# EAGLE board Xtriker_Laser_v2 (EAGLE 9.6.1)
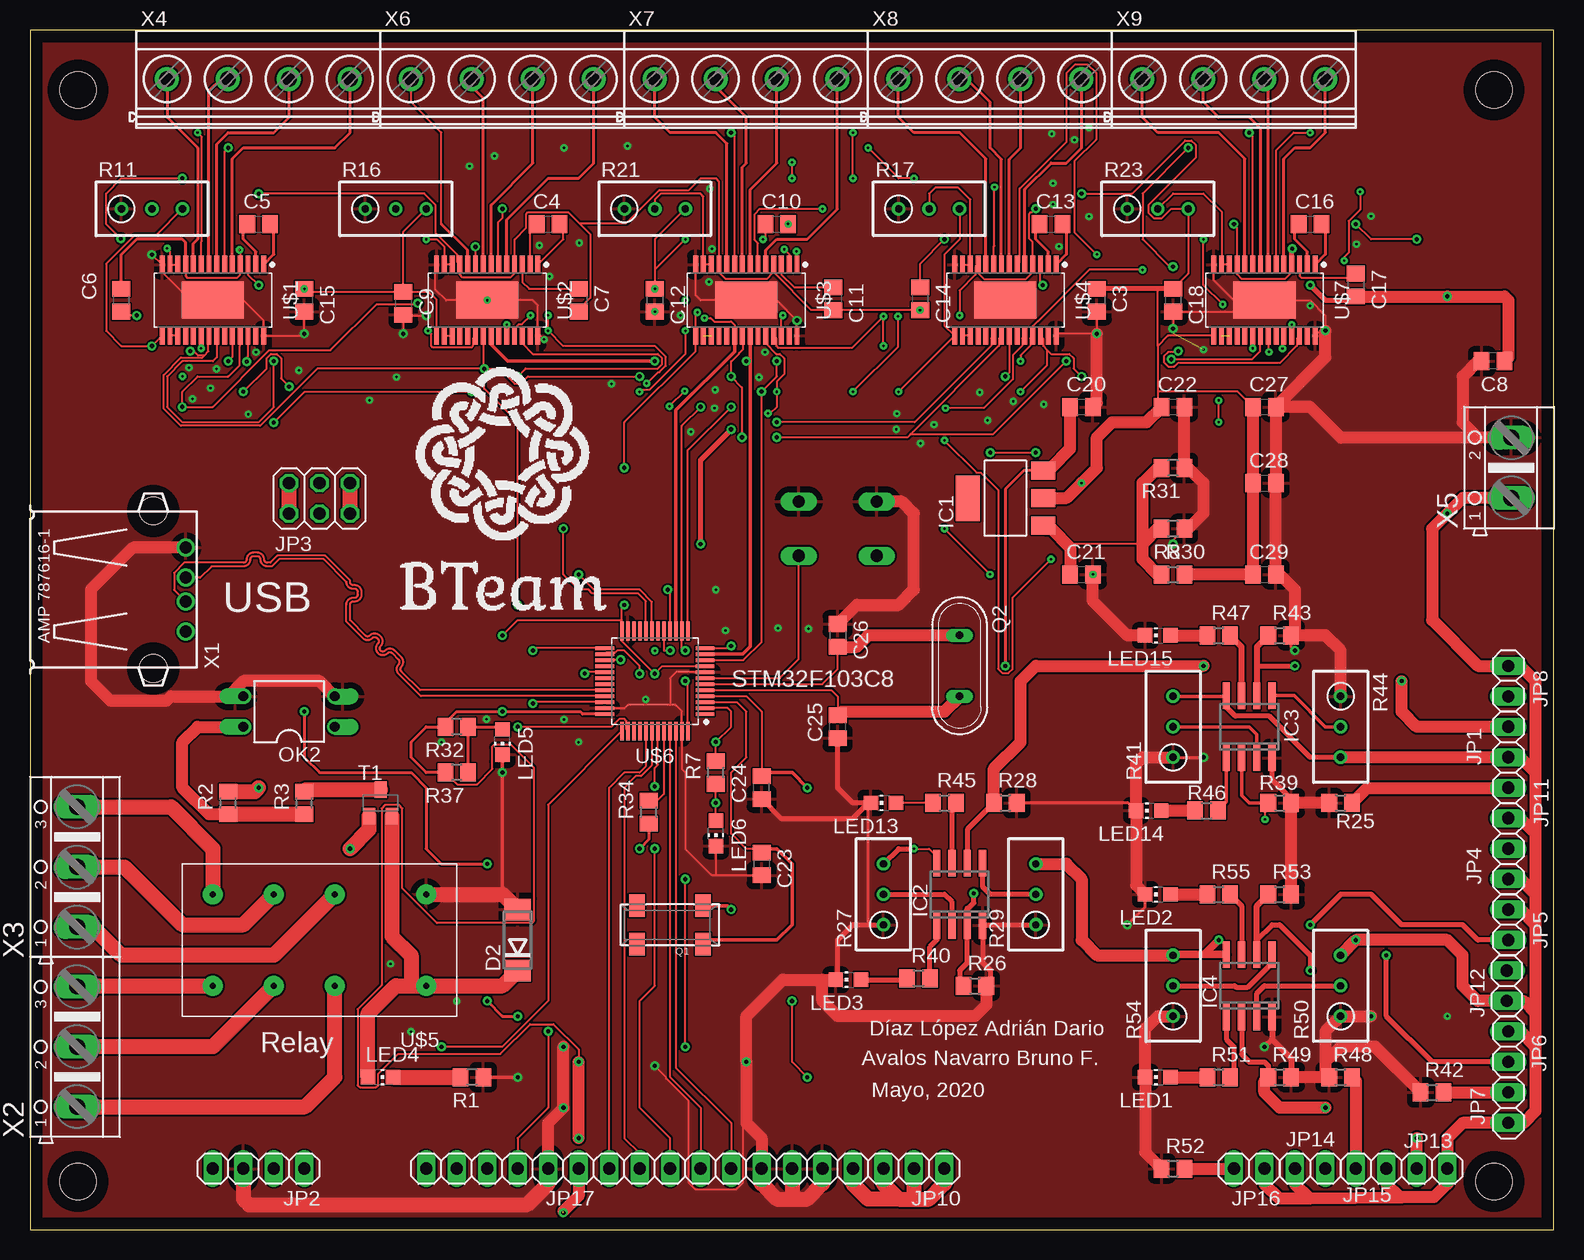
[diagram p2: board, top side]
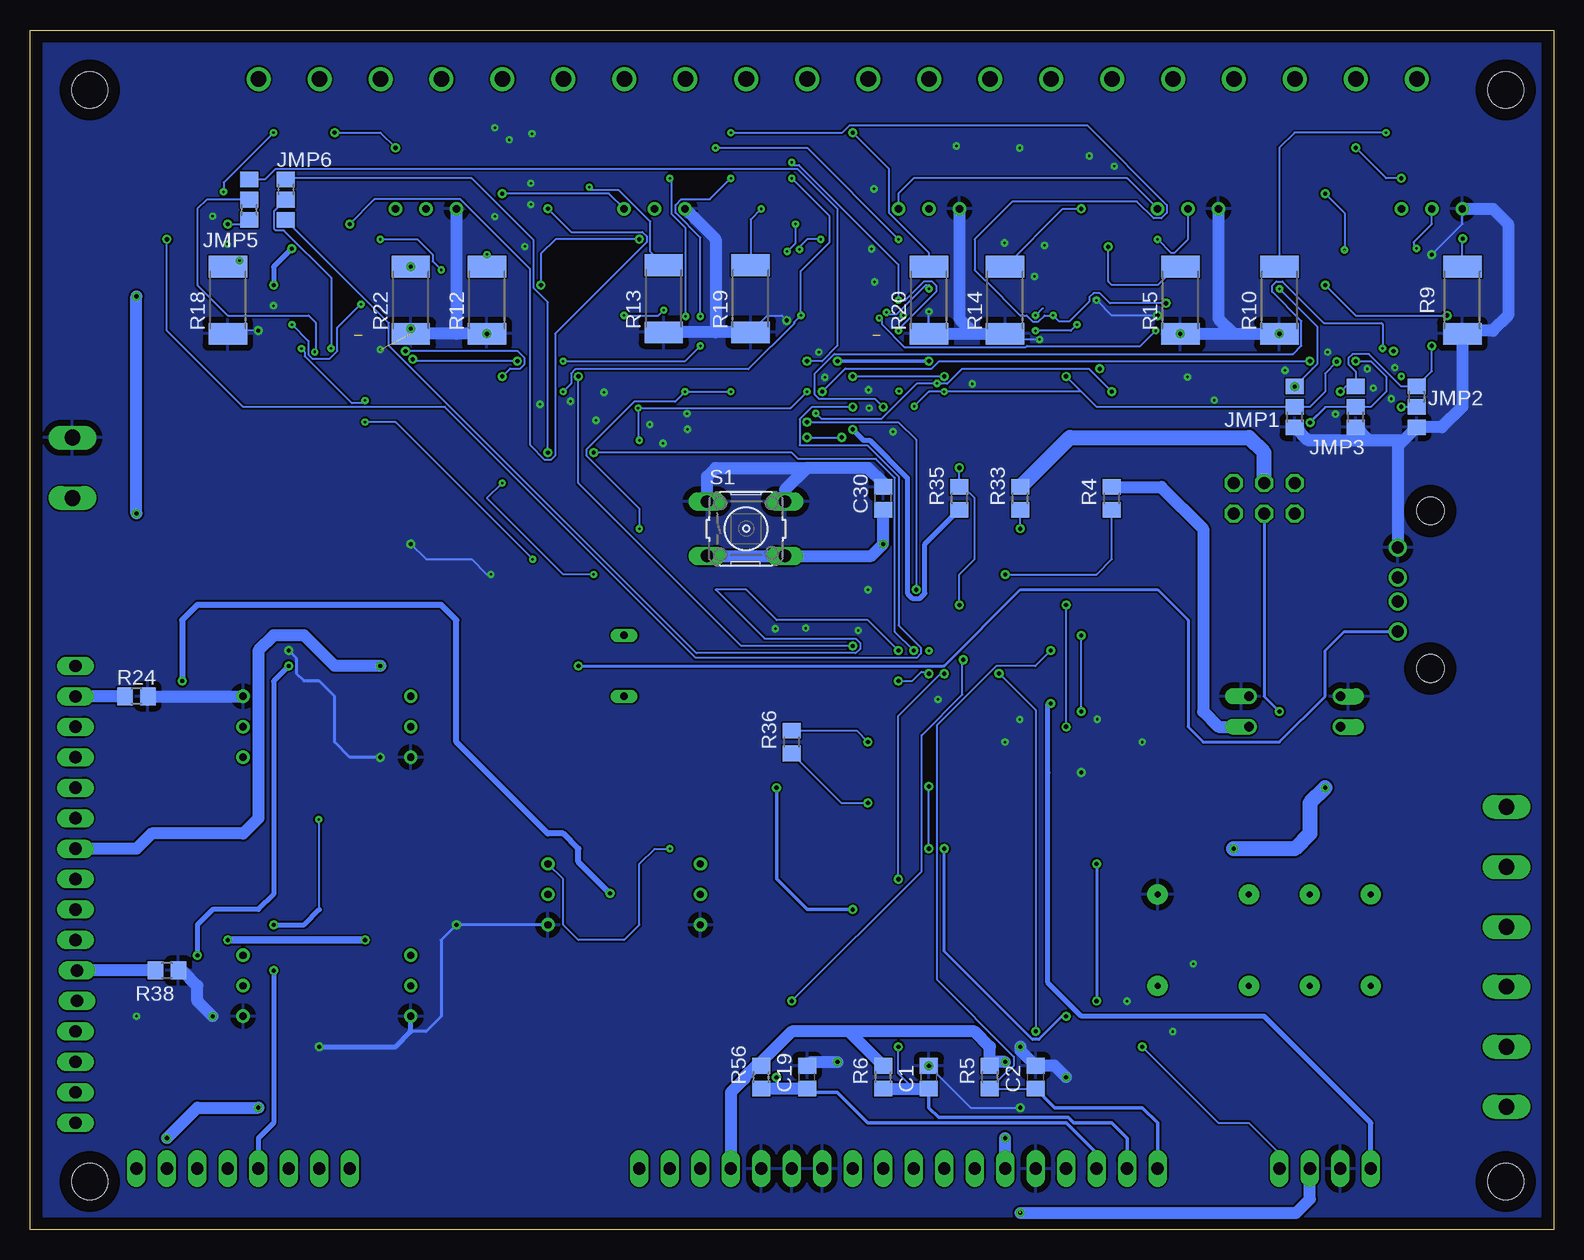
[diagram p3: board, bottom side, seen from below]

Size 126.98 x 100 mm. Coordinates in mm from the lower left corner, seen from the top.
Outline: 0,0 126.98,0 126.98,100 0,100 0,0
Copper layers (1*16): Top 0.035mm / dielectric 1.5mm / Bottom 0.035mm
Design rules "default *": minimum track width 6mil, minimum drill 0.2mm, track to track 6mil, track to pad 6mil, pad to pad 6mil, via to via 6mil, smd to smd 6mil, copper to edge 40mil, drill to drill 10mil, minimum pad ring 10mil, minimum via ring 8mil, stop-mask expansion 4mil, vias tented up to drill 0mil, thermal gap 20mil
Net classes: 1 Diff: width 0.152 mm
Holes 3 mm at 4,95 122,95 122,4 4,4

## Footprints (pad centres in the part's own frame; a part is rotated, then mirrored left to right if it is on the bottom)
C0805 = smd 1.3 x 1.5: 1 -0.95,0; 2 0.95,0
DO214AA = smd 1.8 x 2.2: A 2.55,0; C -2.55,0
SOT223 = smd 1.499 x 2.007: 1 -2.261,-3.15; 2 0.025,-3.15; 3 2.311,-3.15 | smd 3.81 x 2.007: 4 0,3.15
SO08 = smd 0.6 x 2.2: 1 -1.905,-2.6; 2 -0.635,-2.6; 3 0.635,-2.6; 4 1.905,-2.6; 5 1.905,2.6; 6 0.635,2.6; 7 -0.635,2.6; 8 -1.905,2.6
A0R-JMP = smd 1.5 x 1.3: 1 0,1.7; 2 0,0; 3 0,-1.7
1X02 = drill 1.016 long: 1 -1.27,0; 2 1.27,0
1X04 = drill 1.016 long: 1 -3.81,0; 2 -1.27,0; 3 1.27,0; 4 3.81,0
2X03 = drill 1.016 octagon: 1 -2.54,-1.27; 2 -2.54,1.27; 3 0,-1.27; 4 0,1.27; 5 2.54,-1.27; 6 2.54,1.27
1X12 = drill 1.016 long: 1 -13.97,0; 2 -11.43,0; 3 -8.89,0; 4 -6.35,0; 5 -3.81,0; 6 -1.27,0; 7 1.27,0; 8 3.81,0; 9 6.35,0; 10 8.89,0; 11 11.43,0; 12 13.97,0
1X06 = drill 1.016 long: 1 -6.35,0; 2 -3.81,0; 3 -1.27,0; 4 1.27,0; 5 3.81,0; 6 6.35,0
CHIP-LED0805 = smd 1.2 x 1.2: A 0,-1.05; C 0,1.05
DIL04 = drill 0.813 offset: 1 -1.27,-3.81; 2 1.27,-3.81; 3 1.27,3.81; 4 -1.27,3.81
8.2X3.8 = smd 1.3 x 1.9: 1 -2.75,-1.6; 2 2.75,-1.6; 3 2.75,1.6; 4 -2.75,1.6
QS = drill 0.61 long: 1 -2.54,0; 2 2.54,0
R0805 = smd 1.3 x 1.5: 1 -0.95,0; 2 0.95,0
R2512 = smd 1.8 x 3.2: 1 -2.8,0; 2 2.8,0
RTRIM3296W = drill 0.61: 1 0,-2.54; 2 0,0; 3 0,2.54
B3F-10XX = drill 1.016 long: 1 -3.251,2.261; 2 3.251,2.261; 3 -3.251,-2.261; 4 3.251,-2.261
SOT23-BCE = smd 1 x 1.4: B -0.95,-1.1; C 0.95,-1.1; E 0,1.1
SOP65P660X135-29T310X518N = smd 1.478 x 0.407: 1 -2.967,4.225; 2 -2.967,3.575; 3 -2.967,2.925; 4 -2.967,2.275; 5 -2.967,1.625; 6 -2.967,0.975; 7 -2.967,0.325; 8 -2.967,-0.325; 9 -2.967,-0.975; 10 -2.967,-1.625; 11 -2.967,-2.275; 12 -2.967,-2.925; 13 -2.967,-3.575; 14 -2.967,-4.225; 15 2.967,-4.225; 16 2.967,-3.575; 17 2.967,-2.925; 18 2.967,-2.275; 19 2.967,-1.625; 20 2.967,-0.975; 21 2.967,-0.325; 22 2.967,0.325; 23 2.967,0.975; 24 2.967,1.625; 25 2.967,2.275; 26 2.967,2.925; 27 2.967,3.575; 28 2.967,4.225 | smd 3.1 x 5.18: 29 0,0
TDS_1202L = drill 0.5 pad 1.676: P1 -2.54,-2.54; P2 5.08,-2.54; P3 10.16,-2.54; P4 15.24,-2.54; P5 15.24,5.08; P6 10.16,5.08; P7 5.08,5.08; P8 -2.54,5.08
QFP50P900X900X160-48N = smd 1.559 x 0.28: 1 -4.178,2.75; 2 -4.178,2.25; 3 -4.178,1.75; 4 -4.178,1.25; 5 -4.178,0.75; 6 -4.178,0.25; 7 -4.178,-0.25; 8 -4.178,-0.75; 9 -4.178,-1.25; 10 -4.178,-1.75; 11 -4.178,-2.25; 12 -4.178,-2.75; 25 4.178,-2.75; 26 4.178,-2.25; 27 4.178,-1.75; 28 4.178,-1.25; 29 4.178,-0.75; 30 4.178,-0.25; 31 4.178,0.25; 32 4.178,0.75; 33 4.178,1.25; 34 4.178,1.75; 35 4.178,2.25; 36 4.178,2.75 | smd 0.28 x 1.559: 13 -2.75,-4.178; 14 -2.25,-4.178; 15 -1.75,-4.178; 16 -1.25,-4.178; 17 -0.75,-4.178; 18 -0.25,-4.178; 19 0.25,-4.178; 20 0.75,-4.178; 21 1.25,-4.178; 22 1.75,-4.178; 23 2.25,-4.178; 24 2.75,-4.178; 37 2.75,4.178; 38 2.25,4.178; 39 1.75,4.178; 40 1.25,4.178; 41 0.75,4.178; 42 0.25,4.178; 43 -0.25,4.178; 44 -0.75,4.178; 45 -1.25,4.178; 46 -1.75,4.178; 47 -2.25,4.178; 48 -2.75,4.178
USB = drill 1: 1 -3.5,12.99; 2 -1,12.99; 3 1,12.99; 4 3.5,12.99 | hole 2.3: -6.57,10.28; 6.57,10.28
AK500/3 = drill 1.321 long: 1 -5.004,0; 2 0,0; 3 5.004,0
MKDSN1,5/4-5,08 = drill 1.3 pad 2: 1 -7.641,0.025; 2 -2.561,0.025; 3 2.519,0.025; 4 7.599,0.025
AK500/2 = drill 1.321 long: 1 -2.515,0; 2 2.515,0

## Placement (x,y rotation side)
C1  100nF  [C0805]  52.07,12.7 90 bottom
C2  100nF  [C0805]  43.18,12.7 90 bottom
C3  0.47µF  [C0805]  88.9,77.47 270 top
C4  10nF  [C0805]  43.18,83.82 0 top
C5  10nF  [C0805]  19.05,83.82 0 top
C6  0.1µF  [C0805]  7.62,77.47 90 top
C7  0.1µF  [C0805]  45.72,77.47 270 top
C8  100µF  [C0805]  121.92,72.39 180 top
C9  0.47µF  [C0805]  31.11,77.22 270 top
C10  10nF  [C0805]  62.23,83.82 0 top
C11  0.1µF  [C0805]  66.93,77.6 270 top
C12  0.47µF  [C0805]  52.07,77.47 270 top
C13  10nF  [C0805]  85.09,83.82 0 top
C14  0.1µF  [C0805]  74.17,77.6 270 top
C15  0.47µF  [C0805]  22.86,77.47 270 top
C16  10nF  [C0805]  106.68,83.82 0 top
C17  0.1µF  [C0805]  110.49,78.74 270 top
C18  0.47µF  [C0805]  95.25,77.47 270 top
C19  100nF  [C0805]  62.23,12.7 90 bottom
C20  10µF  [C0805]  87.63,68.58 0 top
C21  10µF  [C0805]  87.63,54.61 0 top
C22  10µF  [C0805]  95.25,68.58 0 top
C23  0.1µF  [C0805]  60.96,30.48 270 top
C24  0.1µF  [C0805]  60.96,36.83 90 top
C25  0.1µF  [C0805]  67.31,41.91 90 top
C26  0.1µF  [C0805]  67.31,49.53 270 top
C27  100µF  [C0805]  102.87,68.58 0 top
C28  100µF  [C0805]  102.87,62.23 0 top
C29  100µF  [C0805]  102.87,54.61 0 top
C30  1µF  [C0805]  55.88,60.96 90 bottom
D2  [DO214AA]  40.64,24.13 90 top
IC1  REG1117  [SOT223]  81.28,60.96 90 top
IC2  LM358D  [SO08]  77.47,27.94 0 top
IC3  LM358D  [SO08]  101.6,41.91 0 top
IC4  LM358D  [SO08]  101.6,20.32 0 top
JMP1  0R-JUMPA  [A0R-JMP]  21.59,68.58 180 bottom
JMP2  0R-JUMPA  [A0R-JMP]  11.43,68.58 0 bottom
JMP3  0R-JUMPA  [A0R-JMP]  16.51,68.58 180 bottom
JMP5  0R-JUMPA  [A0R-JMP]  108.71,85.85 180 bottom
JMP6  0R-JUMPA  [A0R-JMP]  105.66,85.85 0 bottom
JP1  [1X02]  123.19,40.64 90 top
JP2  STLINK  [1X04]  19.05,5.08 180 top
JP3  BOOT_SELECTION  [2X03]  24.13,60.96 0 top
JP4  [1X02]  123.19,30.48 90 top
JP5  [1X02]  123.19,25.4 270 top
JP6  [1X02]  123.19,15.24 270 top
JP7  [1X02]  123.19,10.16 90 top
JP8  [1X02]  123.19,45.72 270 top
JP10  PINOUT  [1X12]  62.23,5.08 180 top
JP11  [1X02]  123.19,35.56 90 top
JP12  [1X02]  123.06,20.32 90 top
JP13  [1X02]  116.84,5.08 180 top
JP14  [1X02]  106.68,5.08 0 top
JP15  [1X02]  111.76,5.08 180 top
JP16  [1X02]  101.6,5.08 180 top
JP17  ENDSTOP_&_LASER  [1X06]  39.37,5.08 180 top
LED1  RED  [CHIP-LED0805]  93.98,12.7 90 top
LED2  RED  [CHIP-LED0805]  93.98,27.94 90 top
LED3  GREEN  [CHIP-LED0805]  68.2,20.83 90 top
LED4  ORANGE  [CHIP-LED0805]  29.21,12.7 270 top
LED5  RED  [CHIP-LED0805]  39.37,40.64 180 top
LED6  GREEN  [CHIP-LED0805]  57.15,33.02 180 top
LED13  GREEN  [CHIP-LED0805]  71.12,35.56 90 top
LED14  ORANGE  [CHIP-LED0805]  93.22,34.92 90 top
LED15  ORANGE  [CHIP-LED0805]  93.98,49.53 90 top
OK2  PC817  [DIL04]  21.59,43.18 90 top
Q1  32,768K  [8.2X3.8]  53.34,25.4 180 top
Q2  8MHz  [QS]  77.47,46.99 270 top
R1  470  [R0805]  36.83,12.7 180 top
R2  2k2  [R0805]  16.51,35.56 90 top
R3  10k  [R0805]  22.86,35.56 90 top
R4  200  [R0805]  36.83,60.96 90 bottom
R5  4k7  [R0805]  46.99,12.7 90 bottom
R6  4k7  [R0805]  55.88,12.7 90 bottom
R7  120  [R0805]  57.15,38.1 90 top
R8  820  [R0805]  95.25,58.42 180 top
R9  0.1  [R2512]  7.62,77.47 90 bottom
R10  0.1  [R2512]  22.86,77.47 90 bottom
R11  [RTRIM3296W]  10.16,85.09 270 top
R12  0.1  [R2512]  88.9,77.47 90 bottom
R13  0.1  [R2512]  74.17,77.6 90 bottom
R14  0.1  [R2512]  45.72,77.47 90 bottom
R15  0.1  [R2512]  31.11,77.47 90 bottom
R16  [RTRIM3296W]  30.48,85.09 270 top
R17  [RTRIM3296W]  74.93,85.09 270 top
R18  0.1  [R2512]  110.49,77.47 90 bottom
R19  0.1  [R2512]  66.93,77.6 90 bottom
R20  0.1  [R2512]  52.07,77.47 90 bottom
R21  [RTRIM3296W]  52.07,85.09 270 top
R22  0.1  [R2512]  95.25,77.47 90 bottom
R23  [RTRIM3296W]  93.98,85.09 270 top
R24  4k7  [R0805]  118.11,44.45 180 bottom
R25  470  [R0805]  109.22,35.56 0 top
R26  10k  [R0805]  78.74,20.32 0 top
R27  10k  [RTRIM3296W]  71.12,27.94 0 top
R28  10k  [R0805]  81.28,35.56 0 top
R29  10k  [RTRIM3296W]  83.82,27.94 0 top
R30  100  [R0805]  95.25,54.61 0 top
R31  200  [R0805]  95.25,63.5 180 top
R32  120  [R0805]  35.56,41.91 180 top
R33  100k  [R0805]  44.45,60.96 90 bottom
R34  100k  [R0805]  51.56,34.8 90 top
R35  10k  [R0805]  49.53,60.96 90 bottom
R36  180  [R0805]  63.5,40.64 90 bottom
R37  180  [R0805]  35.56,38.1 180 top
R38  470  [R0805]  115.57,21.59 180 bottom
R39  10k  [R0805]  104.14,35.56 0 top
R40  330  [R0805]  74.04,20.95 0 top
R41  10k  [RTRIM3296W]  95.25,41.91 0 top
R42  470  [R0805]  116.84,11.43 0 top
R43  10k  [R0805]  104.14,49.53 0 top
R44  10k  [RTRIM3296W]  109.22,41.91 180 top
R45  330  [R0805]  76.2,35.56 0 top
R46  330  [R0805]  98.04,34.92 0 top
R47  330  [R0805]  99.06,49.53 0 top
R48  4k7  [R0805]  109.22,12.7 0 top
R49  10k  [R0805]  104.14,12.7 0 top
R50  10k  [RTRIM3296W]  109.22,20.32 0 top
R51  330  [R0805]  99.06,12.7 0 top
R52  470  [R0805]  95.25,5.08 0 top
R53  10k  [R0805]  104.14,27.94 0 top
R54  10k  [RTRIM3296W]  95.25,20.32 0 top
R55  330  [R0805]  99.06,27.94 0 top
R56  4k7  [R0805]  66.04,12.7 90 bottom
S1  RESET_BUTTON  [B3F-10XX]  67.31,58.42 0 bottom
T1  [SOT23-BCE]  29.21,35.56 0 top
U$1  DRV8825  [SOP65P660X135-29T310X518N]  15.24,77.47 270 top
U$2  DRV8825  [SOP65P660X135-29T310X518N]  38.1,77.47 270 top
U$3  DRV8825  [SOP65P660X135-29T310X518N]  59.69,77.47 270 top
U$4  DRV8825  [SOP65P660X135-29T310X518N]  81.28,77.47 270 top
U$5  TDS-1202L  [TDS_1202L]  30.48,25.4 180 top
U$6  STM32F103C8_LQFP48  [QFP50P900X900X160-48N]  52.07,45.72 180 top
U$7  DRV8825  [SOP65P660X135-29T310X518N]  102.87,77.47 270 top
X1  USB_VCP  [USB]  0,53.34 270 top
X2  [AK500/3]  3.94,15.24 90 top
X3  [AK500/3]  3.94,30.23 90 top
X4  MKDSN1,5/4-5,08  [MKDSN1,5/4-5,08]  19.05,95.89 0 top
X5  [AK500/2]  123.44,63.5 90 top
X6  MKDSN1,5/4-5,08  [MKDSN1,5/4-5,08]  39.37,95.89 0 top
X7  MKDSN1,5/4-5,08  [MKDSN1,5/4-5,08]  59.69,95.89 0 top
X8  MKDSN1,5/4-5,08  [MKDSN1,5/4-5,08]  80.01,95.89 0 top
X9  MKDSN1,5/4-5,08  [MKDSN1,5/4-5,08]  100.33,95.89 0 top

## Tracks (layer width: path | path; a pad name or v marks a point on that pad's centre or on a via)
3V  (via drill 0.2, 0.35)  (1 unrouted)
  Top 0.152: 49.32,50.8 U$6.24 49.32,49.08 v52.07,46.33 52.71,46.97 U$6.9 | 49.32,50.8 49.32,51.86 v49.53,52.07 | v49.53,63.5 49.53,67.31 55.47,73.25 U$3.15 55.47,76.32 v55.61,76.47 | U$7.15 94.82,74.5 93.98,73.66 | 93.98,73.66 93.98,69.85 | 93.98,69.85 93.98,68.9 C22.1 | U$2.15 33.88,77.5 33.21,78.17 C9.1 | U$6.48 54.82,45.51 v54.61,45.72 | C9.1 31.11,83.19 R16.3 | R21.3 52.07,82.55 52.07,80.01 | C18.1 96.52,79.69 R23.3 95.09,85.09 94.31,84.3 93.65,84.3 93.19,84.76 93.19,85.42 97.13,89.35 97.13,90.42 96.77,90.78 96.27,90.78 91.85,86.36 v87.63,86.36 | C9.1 23.11,78.17 C15.1 | U$1.15 11,74.5 v10.16,73.66 7.62,73.66 6.35,74.93 6.35,80.51 8.74,82.91 10.52,82.91 R11.3 | JMP1.3 20.93,70.94 20.93,72.64 20.57,73 20.07,73 19.71,72.64 19.71,71.78 v17.78,69.85 | R17.3 77.47,82.55 76.2,81.28 76.2,75.36 U$4.15 72.4,69.85 v72.39,69.85 | R37.2 35.59,37.12 37.26,37.12 38.54,38.41 38.54,40.28 38.67,40.42 40.06,40.42 41.97,38.52 41.97,25.68 41.84,25.55 33.9,25.55 31.02,28.43 31.02,35.12 30.75,35.39 29.57,35.39 29.3,35.12 29.3,20.36 27.3,18.36 27.3,12.04 27.5,11.84 28.82,11.84 29.02,12.04 29.02,12.99 30.67,14.63 39.19,14.63 41.68,17.12 43.62,17.12 45.72,15.01 45.72,12.7 | v39.37,49.53 40.64,50.8 49.32,50.8 | C27.1 100.65,69.85 93.98,69.85 | 93.98,73.66 93.98,78.42 | C12.1 52.07,78.74 52.07,80.01 | v76.2,58.42 v80.01,54.61 | v68.58,69.85 72.34,73.61 v72.34,76.11 | v73.66,87.63 72.39,87.63 v69.85,90.17 | v54.61,82.55 52.07,80.01
  Top 0.254: R37.2 33.02,38.1 31.75,39.37 31.75,40.64 33.02,41.91 R32.2 34.61,42.23 35.56,43.18 v39.37,43.18 45.85,43.18 46.06,42.97 U$6.36
  Top 0.406: C18.1 93.98,78.42 C3.1
  Top 1.016: IC1.2 86.39,60.98 v87.63,62.23 88.9,63.5 88.9,66.04 90.17,67.31 93.03,67.31 C22.1 | R30.2 C29.1 C28.1 C27.1 | v45.72,7.62 45.72,12.7 v45.72,13.97 | JP17.1 45.72,2.79 44.45,1.52
  Top 1.27: JP10.3 71.12,3.81 72.39,2.54 | JP10.1 76.2,3.81 74.93,2.54 73.66,2.54 | 72.39,2.54 73.66,2.54 | JP10.2 73.66,2.54 | 72.39,2.54 69.85,2.54 68.58,3.81 JP10.4
  Bottom 0.152: v49.53,52.07 49.53,54.61 48.26,55.88 48.26,60.96 49.21,61.91 R35.2 v49.53,63.5 | v54.61,45.72 53.47,45.72 52.7,46.48 52.22,46.48 v52.07,46.33 | C12.1 52.07,78.74 52.32,78.74 54.74,76.33 55.47,76.33 v55.61,76.47 | JMP1.3 20.09,71.78 20.07,71.78 19.71,72.14 19.71,75.27 C15.1 | v10.16,73.66 10.16,71.55 JMP2.1 12.7,70.28 15.42,73 16.76,73 17.12,72.64 17.12,72.14 16.51,71.53 JMP3.3 17.35,70.28 v17.78,69.85 | v39.37,43.18 v39.37,49.53 | R16.3 35.56,87.63 53.34,87.63 54.61,86.36 R21.3 | R17.3 78.74,86.36 v87.63,86.36 | v76.2,58.42 76.2,60.1 80.62,64.52 80.62,65.02 76.63,69.01 73.23,69.01 v72.39,69.85 v68.58,69.85 | v80.01,54.61 82.55,54.61 88.9,60.96 v87.63,62.23 | v72.34,76.11 72.34,79.4 72.34,83.5 73.48,84.64 73.48,87.45 v73.66,87.63 | v69.85,90.17 62.23,90.17 v54.61,82.55
  Bottom 1.016: JP10.4 68.58,11.43 67.45,12.56 67.45,12.67 66.47,13.65 R56.2 66.04,13.97 63.5,16.51 58.74,16.51 | R6.2 58.74,16.51 | 58.74,16.51 48.26,16.51 46.99,15.24 R5.2 46.67,13.97 v45.72,13.97 | JP17.1 v45.72,7.62 | v44.45,1.39 21.47,1.39 20.32,2.54 JP2.2
  other vias: 21.59,70.28 52.07,78.42 22.86,78.42
12V  (via drill 0.2, 0.35)  (1 unrouted)
  Top 0.152: U$3.4 62,80.4 62,79.76 | 62,79.76 61.9,79.76 61.39,79.25 57.99,79.25 57.41,79.82 U$3.11 57.41,87.36 57.15,87.63 55.88,87.63 54.91,86.67 52.45,86.67 49.67,83.89 45.79,83.89 | 62,79.76 65.11,76.65 C11.2 C14.2 | C7.2 45.72,76.7 46.7,77.67 46.7,82.97 45.79,83.89 | 45.79,83.89 44.88,84.8 41.48,84.8 41.35,84.67 41.35,83.52 40.38,82.54 U$2.4 40.38,79.75 40.01,79.38 36.07,79.38 35.81,79.63 35.81,80.43 U$2.11 35.61,80.66 35.61,81.27 33.81,83.07 33.81,85.42 32.86,86.36 v19.05,86.36 | 17.55,80.47 U$1.4 | U$1.11 12.96,79.49 13.08,79.38 17.27,79.38 17.52,79.62 U$1.4 | U$7.4 105.14,79.82 104.57,79.25 100.96,79.25 100.58,79.63 100.58,80.43 U$7.11 100.59,83.56 v100.33,83.82 | v83.82,85.1 83.52,84.8 83.39,84.8 83.26,84.67 83.26,82.61 83.56,82.31 U$4.4 83.56,79.82 82.98,79.25 79.5,79.25 79,79.75 U$4.11 78.79,80.22 78.79,79.6 77.47,78.29 v77.47,76.2 | v17.45,81.66 17.52,81.59 U$1.4 | v73.66,31.75 74.93,31.75 75.56,31.11
  Top 0.254: C6.2 7.62,81.28 8.89,82.55 12.7,82.55 12.96,82.28 U$1.11
  Top 0.305: R41.3 99.64,44.45 IC3.8
  Top 0.406: R27.3 72.39,31.75 v73.66,31.75 | 75.56,31.11 IC2.8 | R44.3 106.68,39.37 103.25,42.8 100.46,42.8 99.64,43.62 99.64,44.45 | U$7.4 105.14,81.73 v105.18,81.77 | v106.68,78.74 107.95,77.47 110.17,77.47 C17.2
  Top 0.61: R54.3 95.31,22.92 97.85,22.92 | 97.85,22.92 IC4.8 | v99.06,24.13 97.85,22.92
  Top 1.016: JP15.1 113.03,3.81 114.17,2.67 114.3,2.67 | 114.3,2.67 116.99,2.69 118.11,3.81 JP13.1 118.11,7.62 119.38,8.89 JP7.1 124.46,8.89 125.46,9.89 125.46,15.24 | JP14.1 105.41,3.81 106.63,2.59 | 114.3,2.67 106.68,2.59 106.63,2.59 | JP16.1 102.87,3.81 104.09,2.59 106.63,2.59 | JP6.1 124.19,16.51 125.46,15.24 | 125.46,18.05 124.46,19.05 JP12.1 120.65,19.05 119.38,20.32 119.38,22.86 118.11,24.13 v110.49,24.13 R50.3 | 125.46,18.05 125.46,15.24 | JP5.1 124.19,26.67 125.46,25.4 | 125.46,25.4 125.46,18.05 | JP4.1 124.19,29.21 125.46,27.94 | 125.46,27.94 125.46,25.4 | JP11.1 124.19,34.29 125.46,33.02 | 125.46,33.02 125.46,27.94 | 125.46,38.1 124.19,39.37 JP1.1 R44.3 | 125.46,38.1 125.46,33.02 | 125.46,38.1 125.46,45.72 124.19,46.99 JP8.1 120.65,46.99 116.84,50.8 116.84,58.42 v118.11,59.69 119.41,60.98 X5.1 | C17.2 v118.11,77.79 122.87,77.79 123.19,77.47 123.19,72.71 C8.1 | R29.3 86.36,30.48 87.63,29.21 87.63,24.13 88.9,22.86 R54.3
  Bottom 0.152: v19.05,86.36 17.4,84.71 17.4,81.66 | R29.3 82.55,29.21 82.55,25.4 81.28,24.13 77.47,24.13 76.2,25.4 76.2,30.48 74.93,31.75 v73.66,31.75 | v100.33,83.82 98.27,85.88 91.11,85.88 85.31,80.08 85.31,65.4 84.07,64.16 83.57,64.16 83.21,64.52 83.21,74.68 75.59,82.3 75.59,82.8 75.95,83.16 81.88,83.16 v83.82,85.1 | C14.2 74.61,76.2 v77.47,76.2
  Bottom 0.406: v105.18,81.77 106.68,80.26 v106.68,78.74
  Bottom 0.61: v110.49,24.13 v99.06,24.13
  Bottom 1.016: v118.11,59.69 v118.11,77.79
  other vias: 74.17,76.65
A1_DIR  (via drill 0.2)
  Top 0.152: v101.89,73.46 U$7.20
  Bottom 0.152: JMP6.2 106.48,85.03 106.51,85.03 106.64,84.9 106.64,83.41 106.51,83.27 105.83,83.27 101.89,79.34 v101.89,73.46
A1_STEP  (via drill 0.2)
  Top 0.152: 103.13,74.44 U$7.22 103.19,73.21 v103.25,73.15
  Bottom 0.152: JMP5.2 112.27,85.85 113.03,85.09 113.03,78.74 110.49,76.2 103.76,76.2 103.13,75.57 103.13,73.27 v103.25,73.15
A_AOUT1
  Top 0.254: U$7.5 104.5,89.25 105.41,90.17 106.68,90.17 107.95,91.44 107.95,95.89 X9.4
A_AOUT2
  Top 0.254: U$7.7 103.19,95.56 X9.3
A_BOUT1
  Top 0.254: U$7.10 101.25,89.25 99.06,91.44 93.98,91.44 92.69,92.73 X9.1
A_BOUT2
  Top 0.254: U$7.8 102.55,91.77 101.6,92.71 99.06,92.71 97.77,94 X9.2
A_DIR  (via drill 0.35)
  Top 0.152: U$6.17 52.82,48.26 v53.34,48.26 | v80.01,64.77 v83.82,64.77
  Bottom 0.152: v53.34,48.26 54.9,49.82 54.9,62.66 56.48,64.24 62.97,64.24 63.5,64.77 v80.01,64.77 | v83.82,64.77 83.82,77.3 85.01,78.49 85.01,82.47 90.17,87.63 105.59,87.63 JMP6.1
A_STEP  (via drill 0.35)
  Top 0.152: v58.42,68.58 54.82,64.98 U$6.13 | v115.57,82.55 111.76,82.55 v110.49,83.82
  Bottom 0.152: v58.42,68.58 61.82,68.58 62.84,67.56 62.84,65.38 57.19,65.38 54.6,62.78 54.6,50.38 52.73,48.51 52.73,48.01 53.09,47.65 71.49,47.65 92.41,68.58 109.22,68.58 115.57,74.93 v115.57,82.55 | v110.49,83.82 109.04,83.82 JMP5.1
BOOT0
  Top 0.152: U$6.44 52.82,36.31 52.07,35.56 51.75,35.56 R34.2
BOOT1  (via drill 0.35)
  Top 0.152: v44.45,58.42 44.45,54.61 45.72,53.34 46.56,53.34 46.86,53.03 50.67,53.03 51.32,52.39 U$6.20
  Bottom 0.152: v44.45,58.42 R33.1
CONTROL_CYCLE_START_BIT  (via drill 0.35)
  Top 0.152: JP10.10 53.34,7.62 50.8,10.16 50.8,19.05 52.07,20.32 v52.07,31.75 | v52.07,36.93 52.07,38.48 52.32,38.73 U$6.43
  Bottom 0.152: v52.07,31.75 v52.07,36.93
CONTROL_FEED_HOLD_BIT
  Top 0.152: U$6.42 51.82,38.69 50.93,37.8 50.49,37.8 49.53,36.83 49.53,7.62 50.8,6.35 JP10.11
CONTROL_RESET
  Top 0.152: JP10.12 48.26,36.83 49.53,38.1 50.8,38.1 51.32,38.62 U$6.41
DATA_N
  Top 0.152: U$6.32 32.5,44.97 30.94,46.53 arc-90 30.94,46.91 arc90 30.94,47.72 30.39,48.26 arc90 29.59,48.26 arc-90 29.21,48.26 arc-90 29.21,48.64 arc90 29.21,49.45 29.12,49.53 arc90 28.32,49.53 arc-90 27.94,49.53 26.67,50.8 26.67,52.1 arc-90 26.94,52.37 27.06,52.37 arc90 27.64,52.94 27.64,53.15 arc90 27.06,53.72 26.94,53.72 arc-90 26.67,53.98 26.67,54.11 24.6,56.19 20.62,56.19 20.03,55.59 19.78,55.59 arc-90 19.52,55.86 arc90 18.94,56.43 18.62,56.43 arc90 18.05,55.86 arc-90 17.78,55.59 12.85,55.59 12.01,54.75 12.01,53.32 X1.3
DATA_P
  Top 0.152: U$6.33 32.57,44.47 30.73,46.31 arc-90 30.73,47.12 arc90 30.73,47.5 30.18,48.04 arc90 29.8,48.04 arc-90 28.99,48.04 arc-90 28.99,48.85 arc90 28.99,49.23 28.91,49.31 arc90 28.53,49.31 arc-90 27.72,49.31 26.36,50.67 26.36,52.1 arc-90 26.94,52.67 27.06,52.67 arc90 27.33,52.94 27.33,53.15 arc90 27.06,53.41 26.94,53.41 arc-90 26.36,53.98 24.47,55.88 20.75,55.88 20.16,55.28 19.78,55.28 arc-90 19.21,55.86 arc90 18.94,56.12 18.62,56.12 arc90 18.35,55.86 arc-90 17.78,55.28 15.13,55.28 14.18,54.34 X1.2
ENABLE  (via drill 0.35)
  Top 0.152: 14.52,72.85 14.87,73.21 14.87,74.46 U$1.21 | 14.52,72.85 14.01,72.85 13.63,73.23 v13.36,73.23 | U$2.21 37.77,71.83 v37.85,71.75 | U$6.38 49.69,41.67 49.69,42.42 49.55,42.55 49.09,42.55 48.45,41.91 v40.64,41.91 | v40.64,52.07 40.64,67.31 37.85,70.1 v37.85,71.75 | v37.85,71.75 23.93,71.75 19.18,67 12.57,67 11.12,68.45 11.12,71.25 12.57,72.69 14.36,72.69 14.52,72.85 | v37.85,71.75 39.15,71.75 40.39,70.51 40.89,70.51 41.5,71.12 v50.8,71.12 | U$3.21 59.44,74.43 59.44,73.41 59.1,73.07 59.1,73.03 58.42,72.36 v58.42,71.12 59.33,70.21 v59.33,66.04 | U$4.21 80.74,74.28 80.74,73.67 73.38,66.32 | 73.38,66.32 73.11,66.04 v62.23,66.04 | 73.38,66.32 80.29,66.32 v86.36,72.39 | U$7.21 102.5,74.46 102.5,73.21 101.84,72.55 v95.09,72.55
  Bottom 0.152: v40.64,41.91 v40.64,52.07 | v50.8,71.12 v58.42,71.12 | v62.23,66.04 v59.33,66.04 | v86.36,72.39 94.94,72.39 v95.09,72.55
ENDSTOP_X  (via drill 0.35)
  Top 0.152: U$6.25 42.12,48.47 v41.91,48.26
  Bottom 0.152: R5.1 45.51,13.23 45.41,13.23 44.98,13.66 44.98,14.41 51.41,20.84 51.41,42.03 46.48,46.96 43.21,46.96 v41.91,48.26 | R5.1 C2.1 | R5.1 C2.1 | R5.1 C2.1
  Bottom 0.305: JP17.6 33.02,8.89 34.29,10.16 41.59,10.16 C2.1
ENDSTOP_X1
  Top 0.406: R40.2 74.99,23.56 75.56,24.13 IC2.1
ENDSTOP_X2
  Top 0.406: IC2.7 76.83,35.24 R45.2
ENDSTOP_Y  (via drill 0.35)
  Top 0.152: v54.61,15.24 v54.61,29.21 | v50.8,46.33 50.8,46.99 49.53,48.26 48.92,48.26 48.77,48.1 48.02,48.1 U$6.26
  Bottom 0.152: 53.34,11.75 54.61,13.02 v54.61,15.24 | v54.61,29.21 54.61,42.82 50.8,46.63 v50.8,46.33
  Bottom 0.305: JP17.5 35.56,7.62 36.83,8.89 39.99,8.89 40.45,9.35 51.26,9.35 52.07,10.16 C1.1
  Bottom 1.016: R6.1 53.34,11.75 C1.1
ENDSTOP_Y1
  Top 0.305: IC3.1 99.69,35.63 R46.2
ENDSTOP_Y2
  Top 0.508: IC3.7 100.97,48.58 R47.2
ENDSTOP_Z  (via drill 0.35)
  Top 0.152: v64.77,12.7 63.5,13.97 v63.5,19.05 | v49.21,47.5 49.19,47.47 U$6.27
  Bottom 0.152: 64.77,11.75 v64.77,12.7 | v63.5,19.05 52.68,29.87 52.68,41.2 49.28,44.6 49.28,47.5 v49.21,47.5
  Bottom 0.305: JP17.4 38.1,6.35 40.64,8.89 57.15,8.89 59.69,11.43 61.91,11.43 C19.1
  Bottom 1.016: C19.1 64.77,11.75 R56.1
ENDSTOP_Z1
  Top 0.406: IC4.1 99.69,15.88 100.33,15.24 100.33,13.02 R51.2
ENDSTOP_Z2
  Top 0.406: R55.2 100.97,26.98 IC4.7
GND  (via drill 0.2, 0.35)  (1 unrouted)
  Top 0.152: U$1.28 22.43,74.5 22.86,74.93 C15.2 | U$1.28 22.69,74.5 R10.1 | 80.01,20.64 R26.2 | U$6.35 47.93,43.43 49.53,43.43 49.82,43.72 53.34,43.72 | 53.34,43.72 53.81,43.72 54.32,43.22 U$6.47 54.32,38.39 54.61,38.1 54.61,31.75 56.83,29.53 57.15,29.53 | U$6.8 53.84,46.47 53.34,45.97 53.34,43.72 | C23.2 57.15,29.53 | U$7.28 107.52,74.93 v107.95,74.93 107.95,76.2 106.68,77.47 U$7.29 101.6,77.47 | R15.1 C9.2 31.18,76.2 v33.02,76.2 | 101.6,77.47 100.33,77.47 98.64,79.16 U$7.14 | 101.6,77.47 100.65,76.52 C18.2 v95.25,75.11 95.25,74.93 | 58.74,76.52 U$3.29 | U$3.29 55.88,77.47 55.47,77.89 U$3.14 | U$3.28 v63.91,75.78 62.23,77.47 U$3.29 | U$2.14 33.78,80.34 33.78,78.36 34.67,77.47 U$2.29 41.91,77.47 42.33,77.06 U$2.28 42.53,74.5 v42.84,74.19 | v10.16,81.28 11,80.44 U$1.14 10.98,80.4 10.98,79.86 13.37,77.47 U$1.29 17.78,77.47 19.46,75.78 U$1.28 | C1.2 53.02,12.71 53.02,12.59 54.89,10.72 54.89,3.91 55.47,3.33 58.83,3.33 59.41,3.91 59.41,13.69 v59.69,13.97 | C3.2 R12.1 85.67,74.67 U$4.28 | LED6.C 57.15,29.53 | R8.1 95.25,57.47 v95.25,57.15
  Top 0.254: LED2.C 92.93,26.89 v91.44,25.4 | 69.85,25.4 69.85,35.56 | LED14.C 91.53,35.56 R28.2 | R41.1 v97.79,39.37 | v105.41,48.26 105.09,48.58 R43.2
  Top 0.305: LED5.C v39.37,38.1 39.37,27.94 | R1.1 v40.64,12.7
  Top 0.406: LED3.C 67.31,20.99 67.31,24.13 68.58,25.4 69.85,25.4 R27.1 | R29.1 79.44,25.4 IC2.4 79.38,22.23 80.01,21.59 80.01,20.64 | LED13.C 69.85,35.56 | 69.85,35.56 68.58,35.56 67.31,36.83 C25.1 | C24.1 62.55,34.29 68.58,34.29 69.85,35.56 | 103.5,15.88 v102.87,15.24 | R39.2 105.09,35.88 103.5,37.47 IC3.4
  Top 0.508: IC4.4 103.5,15.88 105.09,14.29 R49.2
  Top 1.016: R8.1 96.52,58.42 97.79,59.69 97.79,62.23 96.52,63.5 R31.1 C22.2 | R44.1 109.22,48.26 107.95,49.53 R43.2 105.41,49.85 105.41,53.34 104.14,54.61 C29.2 C28.2 C27.2 | LED15.C 91.44,49.53 88.58,52.39 C21.2 | X5.2 120.65,66.02 | 120.65,66.02 109.25,66.02 106.68,68.58 C27.2 | C8.2 120.65,72.39 119.38,71.12 119.38,67.28 120.65,66.02 | R41.1 92.71,39.37 92.17,38.83 LED14.C 92.17,28.7 LED2.C | R25.1 R39.2 R53.2 | R48.1 107.95,12.7 | 107.95,12.7 R49.2 | 107.95,13.97 107.95,16.51 R50.1 v111.76,17.78 | 107.95,13.97 107.95,12.7 | R54.1 93.98,17.78 92.93,16.73 LED1.C 92.93,6.45 R52.1 | R42.1 112.08,15.24 109.22,15.24 107.95,13.97 | X1.1 8.58,56.84 5.08,53.34 5.08,45.72 6.7,44.1 11.39,44.1 11.74,44.45 16.51,44.45 | 16.51,44.45 OK2.3 | OK2.2 24.13,45.72 17.78,45.72 16.51,44.45 | C26.1 68.9,52.07 72.39,52.07 73.66,53.34 73.66,59.69 72.67,60.68 S1.1 | 66.04,20.83 62.74,20.83 59.69,17.78 v59.69,13.97 59.69,8.89 60.96,7.62 JP10.7 | 66.04,20.83 LED3.C | R26.2 79.69,18.73 78.74,17.78 67.31,17.78 66.04,19.05 66.04,20.83 | JP17.2 43.18,8.89 v44.45,10.16 v44.45,15.24 | C20.2 88.9,68.9 R12.1 | C27.2 107.95,72.71 v107.95,74.93
  Top 1.27: JP10.7 60.96,3.81 62.23,2.54 63.5,2.54 | 63.5,2.54 64.77,2.54 66.04,3.81 JP10.5 | JP10.6 63.5,2.54 | JP2.3 17.78,2.54 18.26,2.06 40.63,2.06 41.44,2.07 43.18,3.81 JP17.2 | D2.A 39.38,27.94 39.37,27.94 U$5.P1
  Bottom 0.152: v107.95,74.93 110.23,74.93 R18.1 | R19.1 65.53,76.2 64.33,76.2 v63.91,75.78 | v33.02,76.2 36.83,76.2 U$2.29 | v10.16,81.28 7.62,83.82 R11.1 | C1.2 48.58,10.16 v44.45,10.16 | v95.25,57.15 93.98,55.88 90.17,55.88 88.9,54.61 C21.2 | R20.1 C12.2 | v42.84,74.19 45.24,74.19 R14.1
  Bottom 0.254: R29.1 v91.44,25.4 92.71,24.13 92.71,17.78 93.98,16.51 95.25,16.51 | v97.79,39.37 100.33,39.37 101.6,40.64 101.6,44.45 102.87,45.72 104.14,45.72 104.75,46.33 104.75,47.6 v105.41,48.26
  Bottom 0.406: v102.87,15.24 96.52,15.24 95.25,16.51 R54.1
  Bottom 1.016: v111.76,17.78 113.03,19.05 113.03,20.32 114.3,21.59 R38.1 | 12.48,65.83 JMP2.3 9.32,66.88 7.62,68.58 R9.1 7.62,74.93 5.08,74.93 3.81,76.2 3.81,83.82 5.08,85.09 R11.1 | 12.48,65.83 12.99,65.32 X1.1 | JMP3.1 15.46,65.83 | 15.46,65.83 12.48,65.83 | JMP1.1 20.54,65.83 15.46,65.83 | R15.1 26.67,74.67 | 26.67,74.67 R10.1 | R16.1 27.94,75.94 26.67,74.67 | R20.1 48.26,74.67 | 48.26,74.67 R14.1 | C30.2 55.88,62.23 57.15,63.5 62.23,63.5 | S1.2 64.06,61.67 62.23,63.5 | S1.1 70.56,62.79 69.85,63.5 62.23,63.5 | R19.1 69.85,74.8 | 69.85,74.8 R13.1 | R12.1 91.44,74.67 | 91.44,74.67 R22.1 | R21.1 49.53,75.94 48.26,74.67 | 69.85,74.8 69.85,82.55 R17.1 | R23.1 91.44,74.67 | R24.1 R44.1 | C19.2 61.91,13.97 v59.69,13.97 | v40.64,12.7 41.59,13.65 C2.2 44.45,14.92 v44.45,15.24
  other vias: 22.86,74.67 31.11,74.67 52.07,13.65 88.9,74.67 38.1,77.47 52.07,76.52 88.58,54.61 118.11,17.78 57.15,53.34 45.72,40.64 34.29,40.64 31.75,16.51 35.56,19.05 18.19,67.97 45.77,82.25 43.28,79.45 79.15,69.8 79.81,67.46 97.79,73.36 85.24,87.22 85.24,85.45 81.94,69.04 44.5,42.52 51.31,44.2 57.96,49.94 62.33,50.14 64.87,50.09 74.22,65.53 72.19,66.7 72.24,68.02 75.34,67.11 57.1,70 57.05,68.48 55.07,66.5 48.46,70.51 56.59,78.99 84.48,68.78 54.2,76.2 111.76,84.48 110.54,82.14 106.68,77.01 49.78,90.32 44.5,90.17 38.71,89.51 36.63,88.65 30.53,71.07 28.3,69.14 22.4,71.63 88.24,84.45 85.74,81.95 87.04,90.85 85.14,91.35 88.24,91.85 15.04,70.15 13.54,69.25 30.04,22.15 38.04,42.55 42.44,82.05 15.54,71.75 13.24,71.85 18.84,73.15 56.64,86.75 56.84,81.75 60.74,71.05 61.24,73.15
  pour Top: 0,100.33 127,100.33 127,0 0,0
  pour Bottom: 0,100.03 127.2,100.03 127.41,99.82 127.41,-0.2 0.2,-0.2 0,0 0,99.82
GREEN_LED  (via drill 0.35)
  Top 0.152: U$6.2 58.13,43.47 58.42,43.18 58.42,41.91 v57.15,40.64 R7.2 57.79,39.05
  Bottom 0.152: R36.2 58.1,41.59 v57.15,40.64
LASER_ENABLE  (via drill 0.35)
  Top 0.152: U$6.19 51.82,52.32 50.8,53.34 46.99,53.34 v45.72,54.61
  Bottom 0.152: v45.72,54.61 38.1,54.61 36.83,55.88 R4.1
MODE0  (via drill 0.2, 0.35)
  Top 0.152: U$1.24 16.86,72.75 v16.51,72.39 | v20.31,67.28 22.88,69.85 v36.83,69.85 | 39.73,75.12 U$2.24 v39.73,75.44 | v51.39,70.53 52.34,71.48 52.45,71.48 52.98,72.01 52.98,72.77 52.09,73.66 44.45,73.66 v43.18,74.93 v43.18,76.2 | U$3.24 61.31,73.89 62.21,73 62.48,73 62.84,72.64 62.84,71.3 62.23,70.69 v62.23,69.85 62.23,68.58 61.7,68.05 v61.49,68.05 | U$4.24 82.69,74.28 82.69,73.67 81.91,72.89 81.91,70.89 79.5,68.48 v76.3,68.48 | U$7.24 104.36,74.37 v104.36,73.44 | v76.2,65.78 78.89,63.09 79.23,63.09 80.67,61.65 80.67,46.74 81.03,46.38 81.53,46.38 81.89,46.74 81.89,52.68 v85.09,55.88 | v99.06,67.31 v99.06,69.11
  Bottom 0.152: v16.51,72.39 15.24,72.39 13.97,71.12 13.97,69.85 15.24,68.58 JMP3.2 | JMP3.2 19.01,68.58 v20.31,67.28 | JMP3.2 19.05,68.58 20.32,67.31 | v36.83,69.85 38.71,71.73 49.34,71.73 50.55,70.51 51.05,70.51 51.07,70.53 v51.39,70.53 53.07,70.53 55.99,67.61 61.06,67.61 v61.49,68.05 | v43.18,76.2 42.57,76.81 | v62.23,69.85 63.6,68.48 v76.3,68.48 76.3,65.88 v76.2,65.78 | v39.73,75.44 40.23,74.93 v43.18,74.93 | v104.36,73.44 104.09,73.16 104.09,72.81 100.17,68.89 99.06,68.89 v99.06,69.11 | v85.09,55.88 96.52,67.31 v99.06,67.31
MODE1  (via drill 0.2, 0.35)
  Top 0.152: U$1.25 17.52,73.67 17.47,73.62 17.47,72.08 16.51,71.12 13.97,71.12 12.7,69.85 v12.7,68.58 15.22,68.58 19.94,73.3 25.04,73.3 28.89,77.14 32.24,77.14 v32.31,77.22 | U$3.25 62.18,74.28 62.18,73.67 62.32,73.54 68.54,73.54 v71.12,76.11 v71.12,73.66 | v68.58,87.63 v68.58,91.44 | v82.55,72.39 82.55,72.88 83.34,73.67 83.34,74.28 U$4.25 83.56,75.3 83.95,75.69 83.97,75.69 88.28,80.01 v92.71,80.01 | v41.72,76.2 40.99,75.47 40.73,75.47 40.38,75.12 U$2.25 | U$7.25 v105.14,75.44 | v99.4,77.13 97.79,78.74 v97.79,82.55
  Bottom 0.152: JMP2.2 v12.7,68.58 | v32.31,77.22 36.99,77.22 37.85,78.08 38.35,78.08 38.71,77.72 38.71,77.37 40.39,75.69 41.21,75.69 v41.72,76.2 42.43,76.2 42.96,75.67 43.4,75.67 43.93,76.2 44.45,76.2 47.39,79.14 47.41,79.14 48.26,79.99 48.26,82.55 45.11,85.7 34.74,85.7 33.35,84.3 32.69,84.3 32.23,84.76 32.23,85.42 38.86,92.05 58.67,92.05 59.28,91.44 v68.58,91.44 | v71.12,76.11 71.12,82.71 73.18,84.76 73.18,85.42 72.72,85.88 70.33,85.88 v68.58,87.63 | v82.55,72.39 72.39,72.39 v71.12,73.66 | v105.14,75.44 103.78,74.08 103.78,72.93 103.47,72.62 101.98,72.62 101.36,73.24 101.36,75.17 v99.4,77.13 | v92.71,80.01 93.42,80.72 93.42,81.27 94.71,82.55 v97.79,82.55
MODE2  (via drill 0.2, 0.35)  (1 unrouted)
  Top 0.152: U$1.26 18.16,72.78 18.07,72.68 v18.07,72.35 | v40.64,71.12 41.3,71.78 52.32,71.78 52.68,72.14 52.68,72.64 52.32,73 41.92,73 41.02,73.89 U$2.26 | U$7.26 105.58,74.28 105.58,73.67 104.15,72.24 95.65,72.24 95.34,71.94 94.84,71.94 94.49,72.3 94.49,72.8 94.84,73.15 95.6,73.15 v95.69,73.24 | U$4.26 84.42,74.28 84.42,73.67 84.76,73.33 | v87.63,71.12 86.97,71.78 86.97,72.64 86.61,73 85.1,73 84.76,73.33 | v53.29,68.63 v54.56,69.9 | U$3.26 62.62,76.08 v62.74,76.2 | v63.5,87.63 v63.5,88.96 | v50.8,69.85 50.95,70 51.61,70 54.61,73 v54.61,74.93 | v82.55,69.85 84.76,72.06 84.76,73.33
  Bottom 0.152: v18.07,72.35 19.05,71.37 19.05,69.85 20.32,68.58 JMP1.2 38.1,68.58 39.37,69.85 | 39.37,69.85 v40.64,71.12 | v87.63,71.12 86.97,71.78 86.11,71.78 85.75,72.14 85.75,72.64 86.35,73.24 v95.69,73.24 | 39.37,69.85 v50.8,69.85 52.07,69.85 v53.29,68.63 | v63.5,87.63 60.35,84.48 60.35,82.3 62.74,79.92 v62.74,76.2 63.31,75.63 63.31,75.53 67.11,71.73 81.53,71.73 81.89,71.37 81.89,70.51 v82.55,69.85 | v63.5,88.96 63.27,88.73 62.9,88.73 54.61,80.44 v54.61,77.47 54.02,77.47 52.45,79.05 51.84,79.05 51.46,78.67 51.46,78.17 54.61,75.02 v54.61,74.93
N$1
  Top 0.254: C13.2 86.36,83.5 86.36,81.29 U$4.1
N$2
  Top 0.152: U$1.17 U$1.16
N$3
  Top 0.152: U$2.1 44.44,82.55 44.45,82.55 44.45,83.5 C4.2
N$4
  Top 0.152: U$2.2 41.67,83.27 C4.1
N$5
  Top 0.152: U$2.3 41.02,78.99 41.59,78.42 C7.1
N$6  (via drill 0.35)
  Top 0.152: v39.37,85.09 39.37,84.33 38.99,83.95 38.99,80.52 U$2.6
  Bottom 0.152: R14.2 40.9,85.09 v39.37,85.09
N$7  (via drill 0.35)
  Top 0.152: v37.12,81.92 U$2.9
  Bottom 0.152: R15.2 31.49,80.27 33.02,78.74 36.83,78.74 37.12,79.03 v37.12,81.92
N$8  (via drill 0.2)
  Top 0.152: v33.02,82.55 33.9,82.55 34.52,81.92 U$2.13 U$2.12
  Bottom 0.152: R16.2 30.48,82.55 31.63,81.4 31.87,81.4 v33.02,82.55
N$9
  Top 0.152: 92.71,57.15 87,57.15 86.68,56.83
  Top 1.016: IC1.1 84.71,58.42 85.09,58.42 86.68,56.83 C21.1 | R30.1 93.98,54.61 92.71,55.88 92.71,57.15 | 92.71,57.15 93.98,58.42 R8.2 | 92.71,57.15 92.71,62.23 93.98,63.5 R31.2
N$10
  Top 0.254: R32.1 36.83,41.91 | 36.83,41.91 39.15,41.91 LED5.A | R37.1 36.51,41.59 36.83,41.91
N$11
  Top 1.27: JP3.1 JP3.2
N$12
  Top 0.254: U$4.2 84.86,81.52 83.82,82.55 83.82,83.5 C13.1
N$13
  Top 1.27: D2.C 39.38,20.32 U$5.P8 31.75,20.32 | LED4.A 28.16,18 30.48,20.32 31.75,20.32 | T1.C 30.16,24.45 31.75,22.86 31.75,20.32
N$14
  Top 1.27: LED4.C R1.2
N$15  (via drill 0.35)
  Top 1.27: R2.2 18.73,36.51 v19.05,36.83 | v26.67,31.75 28.26,33.34 T1.B
  Bottom 1.27: v19.05,36.83 20.32,35.56 20.32,33.02 21.59,31.75 v26.67,31.75
N$16
  Top 1.016: R2.1 14.92,34.61 12.7,36.83 12.7,40.64 13.97,41.91 OK2.4
  Top 1.27: R3.1 R2.1
N$17
  Bottom 1.016: R4.2 32.7,61.91 29.21,58.42 29.21,43.18 27.94,41.91 OK2.1
N$18
  Top 0.152: U$2.16 U$2.17
N$19  (via drill 0.2)
  Top 0.152: v63.88,81.53 63.91,81.5 U$3.1
  Bottom 0.152: 63.18,82.23 v63.88,81.53 | 63.18,82.23 | 63.18,82.23 C10.2
  other vias: 63.18,83.82
N$20  (via drill 0.2)
  Top 0.152: C10.1 61.28,82.74 v61.09,82.55 | v62.85,81.71 63.27,81.29 U$3.2
  Bottom 0.152: v62.85,81.71 62.85,81.93 62.23,82.55 v61.09,82.55
N$21
  Top 0.152: U$3.3 62.62,79.62 63.69,78.55 C11.1
N$22
  Top 0.254: U$1.1 20.32,81.29 20.32,83.82 C5.2
N$23
  Top 0.254: C5.1 17.78,83.5 17.78,82.55 18.82,81.52 U$1.2
N$24  (via drill 0.35)
  Top 0.152: U$1.3 18.16,79.62 v19.05,78.74 | v8.89,76.2 7.94,76.2 C6.1
  Bottom 0.152: v19.05,78.74 16.51,76.2 v8.89,76.2
N$25  (via drill 0.2)
  Top 0.152: U$3.6 60.66,82.22 60.4,82.48 60.4,84.67 60.83,85.09 v66.04,85.09
  Bottom 0.152: v66.04,85.09 66.93,84.2 R19.2
N$26  (via drill 0.35)
  Top 0.152: U$3.9 58.72,91.14 v58.42,91.44
  Bottom 0.152: v58.42,91.44 55.4,88.42 55.4,84.76 52.07,81.44 R20.2
N$27  (via drill 0.35)
  Top 0.152: v7.57,82.6 6.35,83.82 6.35,86.36 7.62,87.63 v12.7,87.63 | U$1.6 16.21,89.88 v16.51,90.17
  Bottom 0.152: R9.2 7.62,82.55 v7.57,82.6 | v12.7,87.63 13.97,87.63 v16.51,90.17
N$28
  Top 0.152: U$3.12 U$3.13 56.12,86.12 55.88,86.36 52.58,86.36 52.07,85.85 R21.2
N$29
  Top 1.27: X2.1 22.94,10.24 25.4,12.7 U$5.P7
N$30
  Top 1.27: U$5.P6 15.24,15.24 X2.2
N$31
  Top 1.27: X2.3 4.01,20.32 U$5.P5
N$32
  Top 1.27: X3.3 11.76,35.23 15.24,31.75 U$5.P4
N$33
  Top 1.27: X3.2 7.87,30.23 12.7,25.4 17.78,25.4 U$5.P3
N$34
  Top 1.27: U$5.P2 20.32,22.86 7.62,22.86 5.08,25.4 4.12,25.4 X3.1
N$35  (via drill 0.35)
  Top 0.152: LED6.A v57.15,35.56 R7.1
  Top 0.305: 57.15,34.29 LED6.A
  Bottom 0.152: R36.1 59.37,35.56 v57.15,35.56
N$36  (via drill 0.35)
  Top 0.152: C14.1 74.17,80.52 v76.2,82.55 | v84.4,78.74 84.2,78.94 U$4.3
  Bottom 0.152: v76.2,82.55 83.19,82.55 84.4,81.33 v84.4,78.74
N$37  (via drill 0.2)
  Top 0.152: U$1.9 14.27,82.34 14.33,82.4 14.33,91.08 v13.97,91.44
  Bottom 0.152: v13.97,91.44 21.59,91.44 22.86,90.17 R10.2
N$38  (1 unrouted)
N$39
  Top 0.406: LED3.A 72.96,20.83 R40.1
N$40  (via drill 0.35)
  Top 0.406: R26.1 77.47,20.64 77.47,21.59 78.11,22.23 IC2.3 | 78.11,26.67 78.65,27.21 v78.65,28.03
  Top 0.508: IC2.3 78.11,26.67 78.11,26.76
  Top 1.016: JP1.2 115.57,41.91 114.3,43.18 v114.3,45.72
  Bottom 0.508: v78.65,28.03 81.28,30.66 81.28,31.75 82.55,33.02 83.82,33.02 91.44,40.64 91.44,50.8 92.71,52.07 113.03,52.07 114.3,50.8 v114.3,45.72
N$41
  Top 1.27: JP3.5 JP3.6
N$42  (via drill 0.35)
  Top 0.254: R34.1 51.56,32.51 v50.8,31.75 | v22.86,43.18 22.86,39.37 24.13,38.1 31.75,38.1 33.02,36.83 33.02,31.75 34.29,30.48 v38.1,30.48 | v38.1,19.05 39.37,17.78 v40.64,17.78
  Bottom 0.254: JP3.3 24.13,44.45 v22.86,43.18 | v38.1,30.48 v38.1,19.05 | v40.64,17.78 40.98,17.78 42.91,15.85 43.45,15.85 50.8,23.2 v50.8,31.75
N$43
  Bottom 1.27: R33.2 40.32,66.04 25.4,66.04 24.13,64.77 JP3.4
N$44  (via drill 0.2)
  Top 0.152: U$1.12 U$1.13 11.66,81.55 v11.43,81.79
  Bottom 0.152: R11.2 10.16,83.82 11.68,82.3 11.68,81.79 v11.43,81.79
N$45
  Bottom 1.016: R24.2 JP8.2
N$46  (via drill 0.35)
  Top 0.406: R28.1 78.11,33.34 IC2.6
  Top 1.016: R28.1 80.33,38.42 82.55,40.64 82.55,45.72 83.82,46.99 v97.79,46.99
  Bottom 1.016: v97.79,46.99 101.6,46.99 104.14,49.53 106.68,49.53 107.95,48.26 107.95,34.29 109.22,33.02 116.84,33.02 118.11,31.75 JP4.2
N$47
  Top 0.406: R27.2 76.2,27.94 76.83,27.3 IC2.2
N$48
  Top 1.016: R25.2 111.44,36.83 JP11.2
N$49
  Top 0.152: 79.38,30.48 IC2.5
  Top 0.406: R29.2 80.01,27.94 79.38,28.57 79.38,30.48
N$50  (via drill 0.2, 0.35)
  Top 0.152: v102.92,34.19 102.92,35.29 R39.1
  Top 0.305: IC3.2 100.97,36.2 101.6,35.56 R39.1
  Top 0.406: JP5.2 120.65,24.13 119.38,25.4 114.3,25.4 111.76,27.94 109.22,27.94 v106.68,25.4
  Bottom 0.152: 102.87,26.67 102.87,34.14 v102.92,34.19
  Bottom 0.406: v106.68,25.4 104.14,25.4 102.87,26.67
N$51
  Bottom 1.016: R38.2 JP12.2
N$52
  Top 0.305: IC3.3 102.23,41.27 101.6,41.91 R41.2
N$53  (via drill 0.35)
  Top 0.406: 102.23,46.99 v105.41,46.99 | JP6.2 116.84,13.97 113.03,17.78 v113.03,22.86
  Top 0.508: IC3.6 102.23,46.99 102.23,48.58 R43.1
  Bottom 0.406: v105.41,46.99 106.68,45.72 106.68,27.94 107.95,26.67 111.76,26.67 113.03,25.4 v113.03,22.86
N$54
  Top 1.016: R42.2 JP7.2
N$55
  Top 0.305: R44.2 107.95,41.91 105.35,44.51 IC3.5
N$56
  Top 0.152: R45.1 LED13.A
N$57
  Top 1.016: LED14.A R46.1
N$58
  Top 1.016: LED15.A R47.1
N$59  (via drill 0.2)
  Top 0.152: U$4.6 82.47,80.66 82.47,86.79 86.38,90.69 86.38,96.42 87.1,97.14 88.12,97.14 88.84,96.42 88.84,90.88 87.02,89.06 87.02,83.16 v88.9,81.28
  Bottom 0.152: v88.9,81.28 R12.2
N$60  (via drill 0.2)
  Top 0.152: U$4.9 80.31,81.95 80.37,82.02 v80.37,86.89
  Bottom 0.152: R13.2 75.29,81.52 75.29,84.02 77.93,86.67 80.31,86.67 80.39,86.74 80.39,86.87 v80.37,86.89
N$61
  Top 0.152: R17.2 74.93,86.36 75.44,86.87 77.34,86.87 78.36,85.86 U$4.12 U$4.13
N$62
  Top 0.152: U$4.17 U$4.16
N$63
  Top 0.254: C16.2 107.95,83.5 107.95,81.29 U$7.1
N$64
  Top 0.254: U$7.2 106.44,81.52 105.41,82.55 105.41,83.5 C16.1
N$65
  Top 0.152: U$7.3 105.8,79.5 105.92,79.38 110.17,79.38 C17.1
N$66  (via drill 0.2)
  Top 0.152: U$7.6 103.84,89.98 105.31,91.44 v106.68,91.44 | v110.85,86.51 110.85,85.03 109.88,84.07 109.88,81.44 109.42,80.97 109.42,80.87 v109.53,80.77
  Bottom 0.152: v106.68,91.44 110.85,87.27 v110.85,86.51 | v109.53,80.77 110.03,80.27 R18.2
N$67  (via drill 0.35)
  Top 0.152: U$7.9 101.89,91.14 v101.6,91.44 | v96.52,90.17 92.71,86.36 92.71,82.55 94.99,80.27 R22.2
  Bottom 0.152: v101.6,91.44 97.79,91.44 v96.52,90.17
  other vias: 95.25,80.27
N$68
  Top 0.152: R23.2 95.25,86.36 97.79,86.36 99.3,84.86 U$7.13 U$7.12
N$69  (1 unrouted)
N$70  (via drill 0.35)
  Top 0.406: IC4.2 100.97,14.61 101.6,13.97 102.87,13.97 103.19,13.65 R49.1
  Top 1.016: JP13.2 v115.57,7.62 | v107.95,10.16 104.14,10.16 102.87,11.43 102.87,12.38 R49.1
  Bottom 1.016: v115.57,7.62 113.03,10.16 v107.95,10.16
N$71
  Top 1.016: R48.2 110.49,12.38 JP15.2
N$72
  Top 0.406: IC4.3 102.23,19.68 102.87,20.32 R50.2
N$73
  Top 1.016: LED1.A R51.1
N$74  (via drill 0.35)
  Top 0.406: 102.23,24.13 103.5,25.4 104.14,25.4 106.68,22.86 v106.68,21.59
  Top 0.508: IC4.6 102.23,24.13 102.23,26.98 R53.1
  Bottom 0.406: v106.68,21.59 106.68,8.89 107.95,7.62 JP14.2
N$75
  Top 1.016: R52.2 JP16.2
N$76
  Top 0.406: IC4.5 103.5,22.23 101.47,20.19 100.52,20.19 100.39,20.32 R54.2
N$77
  Top 1.016: LED2.A R55.1
N$79  (via drill 0.2)
  other vias: 52.07,48.26
N$80  (via drill 0.2)
  other vias: 12.7,71.12
OSCIN
  Top 0.152: U$6.5 66.79,44.97 67.31,44.45 C25.2
  Top 1.016: C25.2 67.63,43.18 76.2,43.18 Q2.2
OSCOUT
  Top 0.152: U$6.6 66.04,45.47 67.31,46.74 67.31,48.26 C26.2
  Top 1.016: Q2.1 69.85,49.53 68.9,48.58 C26.2
PC14
  Top 0.152: U$6.3 58.9,43.97 59.69,43.18 59.69,39.37 58.42,38.1 58.42,33.02 59.69,31.75 60.64,31.75 C23.1
  Top 0.305: Q1.4 56.42,24.13 62.23,24.13 63.5,25.4 63.5,30.48 62.23,31.75 61.28,31.75 C23.1
PC15  (via drill 0.35)
  Top 0.152: U$6.4 59.67,44.47 60.96,43.18 C24.2
  Top 0.305: Q1.1 58.09,27 v58.42,26.67 | v64.77,36.83 63.5,38.1 61.28,38.1 C24.2
  Bottom 0.305: v58.42,26.67 62.23,26.67 64.77,29.21 v64.77,36.83
PROBE
  Top 0.152: U$6.46 53.82,13.49 58.42,8.89 JP10.8
PWM_LASER  (via drill 0.35)
  Top 0.152: U$6.29 46.34,46.47 v46.23,46.35 | v43.18,16.51 43.18,10.16 40.64,7.62 JP17.3
  Bottom 0.152: v46.23,46.35 43.18,43.31 v43.18,16.51
RESET  (via drill 0.35)
  Top 0.152: U$6.7 62.48,45.97 64.06,47.55 S1.4
  Top 0.406: v55.88,57.15 55.88,64.16 v58.42,66.7
  Bottom 0.406: v58.42,66.7 57.52,65.81 57.01,65.81 53.87,62.67 53.87,53.04 53.44,52.61 52.83,52.61 52.4,53.04 52.4,57.14 R35.1
  Bottom 1.016: C30.1 v55.88,57.15 56.87,56.16 S1.4 S1.3
SAFETY_STOP
  Top 0.152: U$6.45 53.32,12.72 55.88,10.16 JP10.9
SWCLK  (via drill 0.35)
  Top 0.152: U$6.37 43.18,35.4 43.18,19.05 39.37,15.24 v34.29,15.24
  Bottom 0.152: v34.29,15.24 27.94,8.89 25.4,8.89 22.86,6.35 JP2.1
SWIO  (via drill 0.35)
  Top 0.152: U$6.34 42.02,43.97 v41.91,43.86
  Bottom 0.406: JP2.4 15.24,8.89 24.13,17.78 39.37,17.78 42.16,20.57 42.16,38.1 42.16,43.81 42.12,43.86 v41.91,43.86
USB_5V  (via drill 0.35)
  Top 0.254: IC1.3 82.83,63.27 81.28,61.72 v81.28,46.99
  Top 1.016: IC1.3 84.66,63.5 85.09,63.5 86.68,65.09 C20.1
  Bottom 0.254: v81.28,46.99 50.8,46.99 44.45,53.34 33.02,53.34 30.48,50.8 30.48,41.91 29.21,40.64 22.86,40.64 19.05,44.45 19.05,48.26 17.47,49.84 X1.4
VDD
  Top 1.27: T1.E 23.01,36.66 R3.2
X_AOUT1
  Top 0.254: U$1.5 16.86,89.25 17.78,90.17 25.4,90.17 26.67,91.44 26.67,95.89 X4.4
X_AOUT2
  Top 0.254: U$1.7 15.56,90.5 16.51,91.44 20.32,91.44 21.59,92.71 21.59,95.89 X4.3
X_BOUT1
  Top 0.254: U$1.10 13.62,82.19 13.97,82.55 13.97,90.17 11.43,92.71 11.43,95.89 X4.1
X_BOUT2
  Top 0.254: U$1.8 14.91,94.92 15.9,95.91 X4.2
X_DIR  (via drill 0.2, 0.35)
  Top 0.152: v54.61,48.26 54.48,48.26 54.32,48.42 U$6.14 54.32,67.02 v55.88,68.58 | U$1.20 v14.27,73.46
  Bottom 0.152: v54.61,48.26 57.15,50.8 64.77,50.8 67.31,53.34 69.85,53.34 65.77,49.26 58.17,49.26 57.81,48.9 57.81,48.4 58.17,48.05 71.45,48.05 97.08,73.67 97.08,75.57 JMP6.3 | v55.88,68.58 56.54,69.24 61.21,69.24 61.57,69.6 61.57,71.37 59.94,73 21.71,73 21.03,73.67 21.03,75.73 23.47,78.17 23.47,78.67 23.11,79.03 22.61,79.03 19.15,75.56 14.35,75.56 14.27,75.48 v14.27,73.46
X_STEP  (via drill 0.35)
  Top 0.152: U$1.22 15.56,72.72 15.24,72.39 12.7,72.39 11.43,71.12 11.43,68.58 12.7,67.31 19.05,67.31 20.32,68.58 v20.32,72.39 | U$6.10 59.44,47.47 60.96,48.99 v60.96,69.85 62.23,71.12 v62.23,72.39
  Bottom 0.152: v20.32,72.39 51.21,72.39 51.82,71.78 59.03,71.78 v60.96,69.85 | JMP5.3 107.39,87.55 106.51,88.43 63.03,88.43 59.69,85.09 59.69,73.68 60.98,72.39 v62.23,72.39
Y1_AOUT1
  Top 0.254: U$2.5 39.73,84.17 43.18,87.63 45.72,87.63 46.97,88.88 X6.4
Y1_AOUT2
  Top 0.254: U$2.7 38.42,85.42 41.91,88.9 41.91,95.89 X6.3
Y1_BOUT1
  Top 0.152: 34.29,83.82 34.29,91.44 31.75,93.98 31.75,95.89
  Top 0.254: U$2.10 36.48,81.64 34.29,83.82 | 31.75,95.89 X6.1
Y1_BOUT2
  Top 0.254: U$2.8 37.77,94.31 36.81,95.27 X6.2
Y2_AOUT1
  Top 0.254: U$3.5 61.31,81.64 62.23,82.55 64.77,82.55 67.29,85.07 X7.4
Y2_AOUT2
  Top 0.254: U$3.7 60.02,86.69 62.23,88.9 62.23,95.89 X7.3
Y2_BOUT1
  Top 0.254: U$3.10 58.06,90.53 57.15,91.44 53.34,91.44 52.05,92.73 X7.1
Y2_BOUT2
  Top 0.254: U$3.8 59.37,88.58 59.69,88.9 59.69,92.71 57.13,95.27 X7.2
Y_DIR  (via drill 0.2)
  Top 0.152: v33.17,74.93 33.44,74.66 33.44,73.67 33.58,73.54 36.77,73.54 36.91,73.67 36.91,74.28 U$2.20 | v56.21,75.99 56.71,75.99 57.01,75.69 58.42,75.69 58.72,75.4 U$3.20
  Top 0.305: U$3.20 58.72,73.19 53.82,68.3 U$6.15
  Bottom 0.152: v56.21,75.99 55.98,75.76 55.98,75.44 54.08,73.54 44.02,73.54 43.91,73.66 34.44,73.66 v33.17,74.93
Y_STEP  (via drill 0.35)
  Top 0.305: 60.02,72.39 60.02,48.59 59.4,47.97 U$6.11 | 60.02,72.39 U$3.22 | U$2.22 38.44,74.49 38.44,73.77 39.81,72.39 v52.07,72.39 | v59.69,72.39 60.02,72.39
  Bottom 0.305: v52.07,72.39 v59.69,72.39
Z_AOUT1
  Top 0.254: U$4.5 82.91,86.72 85.09,88.9 86.36,88.9 87.63,90.17 87.63,95.89 X8.4
Z_AOUT2
  Top 0.254: U$4.7 81.61,89.22 82.55,90.17 82.55,95.89 X8.3
Z_BOUT1
  Top 0.254: U$4.10 79.66,89.25 77.47,91.44 73.66,91.44 72.37,92.73 X8.1
Z_BOUT2
  Top 0.254: U$4.8 80.95,89.22 80.01,90.17 80.01,93.98 78.08,95.91 X8.2
Z_DIR  (via drill 0.35)
  Top 0.152: U$4.20 80.09,74.28 80.09,73.67 73.73,67.31 v62.23,67.31 | v53.14,53.34 53.32,53.16 U$6.16
  Bottom 0.152: v62.23,67.31 54.61,67.31 53.14,65.84 v53.14,53.34
Z_STEP  (via drill 0.35)
  Top 0.152: U$6.12 58.42,48.47 v58.42,48.65 | U$4.22 81.61,71.44 v81.28,71.12
  Bottom 0.152: v58.42,48.65 67.7,48.65 81.28,62.23 v81.28,71.12

## Text on the board
tPlace: USB | STM32F103C8 | Díaz López Adrián Dario | Relay | Avalos Navarro Bruno F. | Mayo, 2020